# Altium project Mother Board.PrjPcb (part 1 of 2)
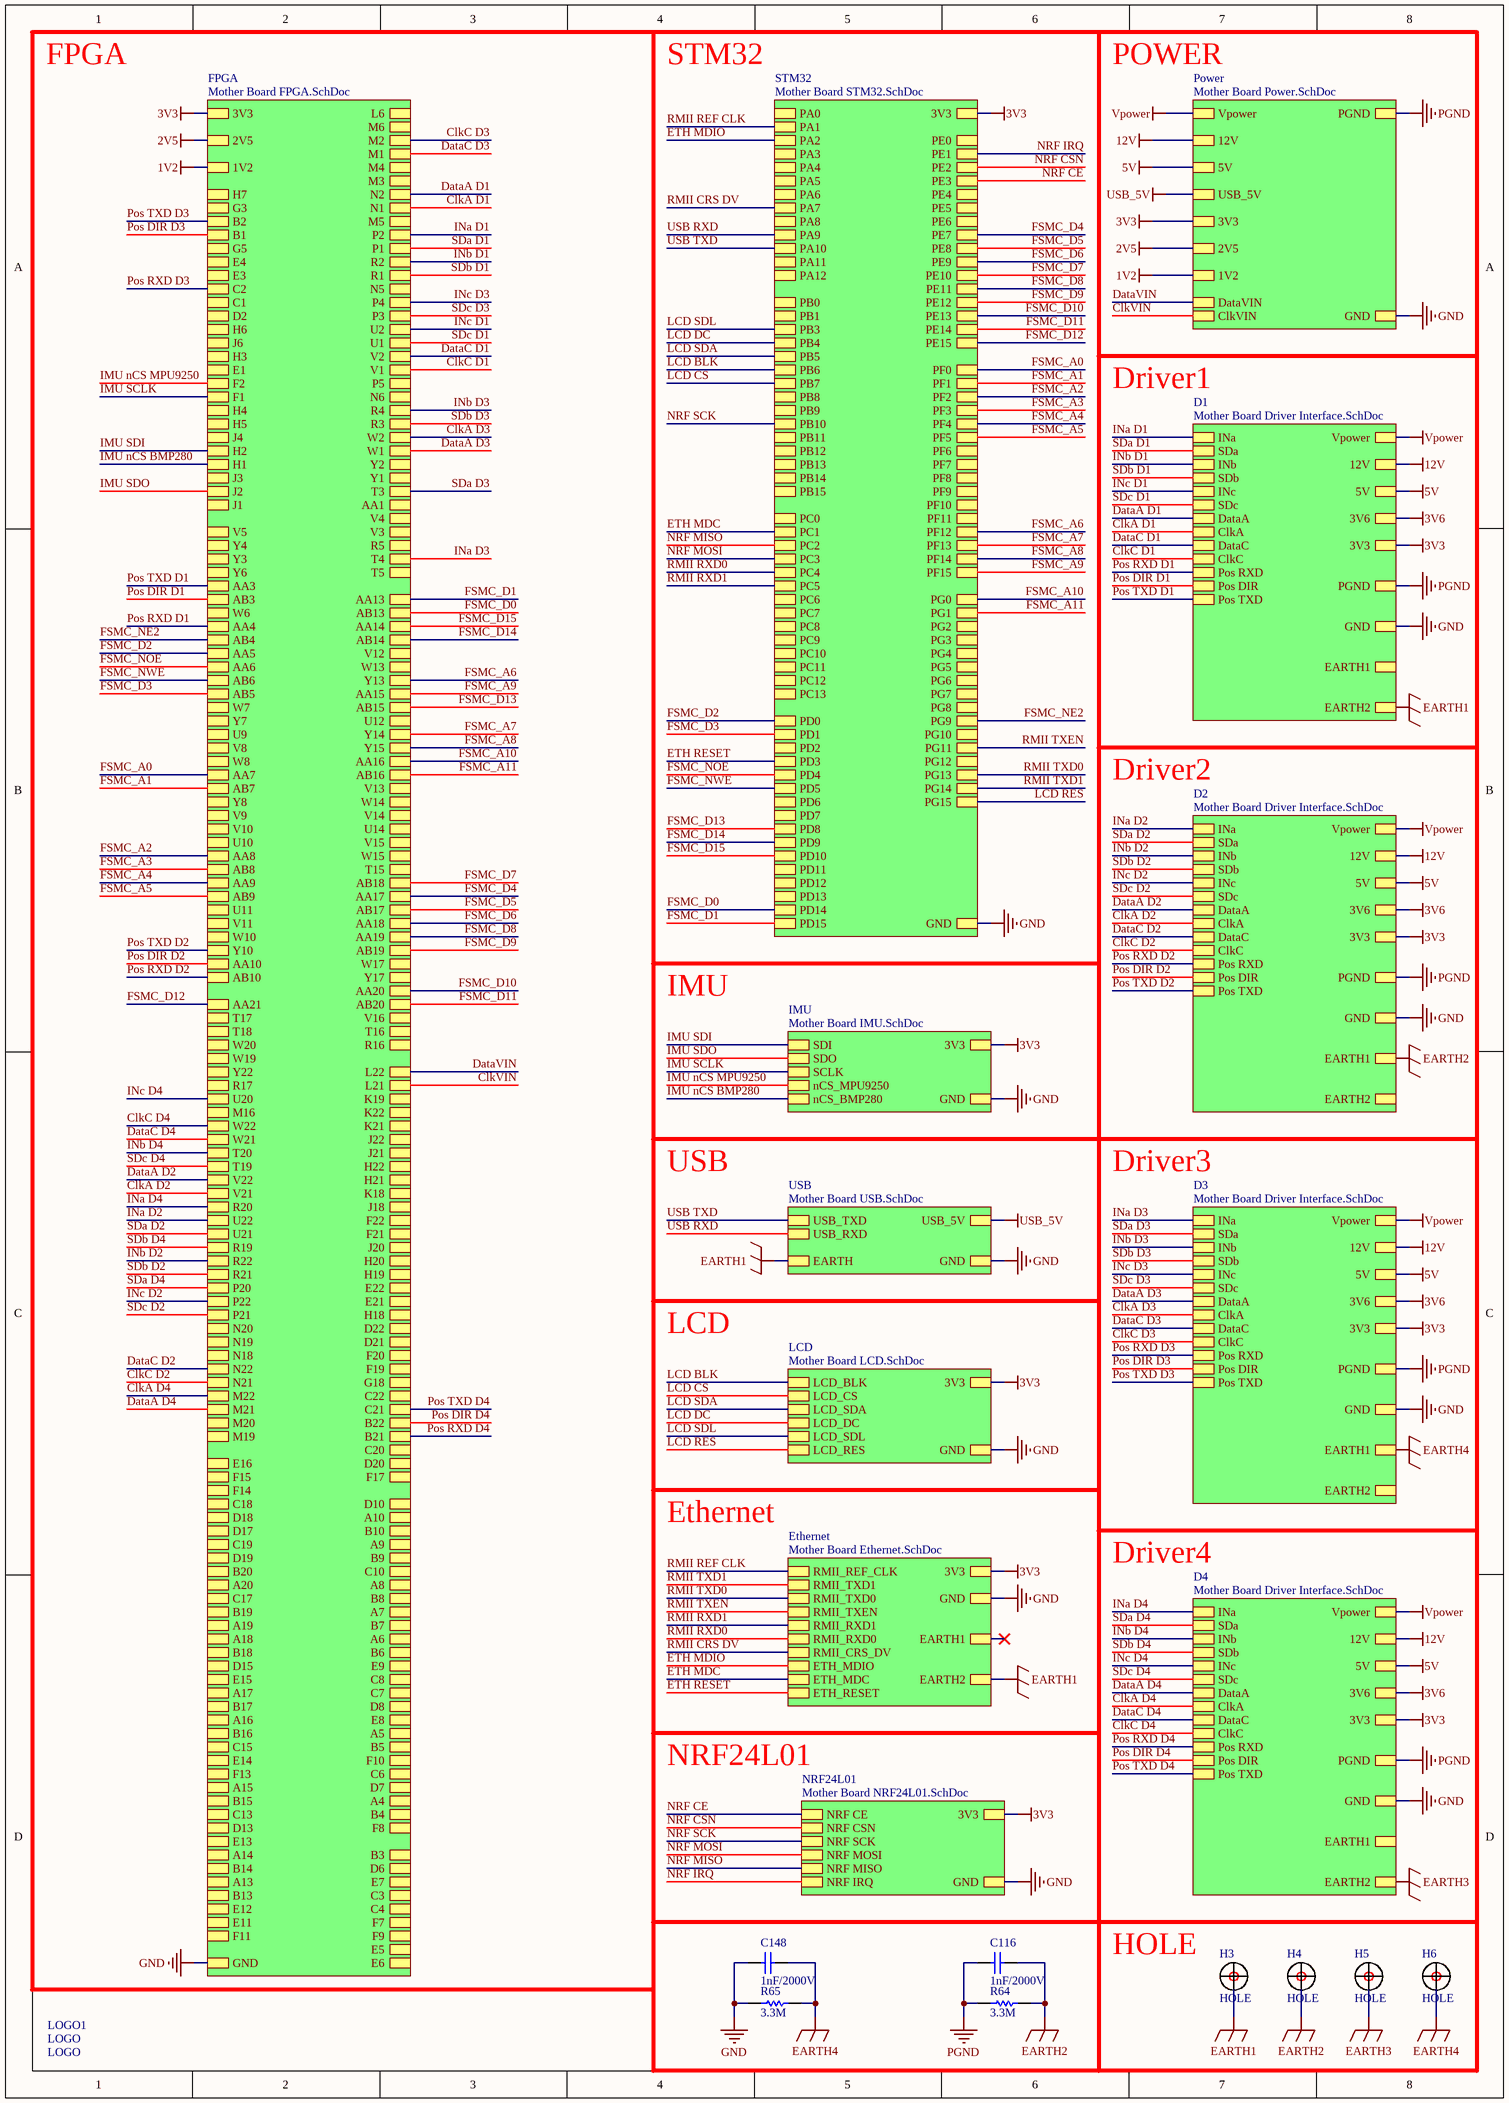
[diagram p0: Mother Board Main.SchDoc]
10 sheets, 316 parts. Net scope: hierarchical (ports join the sheet entries above them; power ports are global).
Board file: Mother  Board.PcbDoc
Sheets:
  Mother Board Main.SchDoc
    Power = Mother Board Power.SchDoc
    NRF24L01 = Mother Board NRF24L01.SchDoc
    IMU = Mother Board IMU.SchDoc
    USB = Mother Board USB.SchDoc
    LCD = Mother Board LCD.SchDoc
    Ethernet = Mother Board Ethernet.SchDoc
    D4 = Mother Board Driver Interface.SchDoc
    FPGA = Mother Board FPGA.SchDoc
    STM32 = Mother Board STM32.SchDoc
    D3 = Mother Board Driver Interface.SchDoc
    D2 = Mother Board Driver Interface.SchDoc
    D1 = Mother Board Driver Interface.SchDoc

## Sheet Mother Board Main.SchDoc
size A3 portrait

### Parts
C116  1nF/2000V  [C1206]
C148  1nF/2000V  [C1206]
H3  HOLE  [定位孔 Φ3 1]
H4  HOLE  [定位孔 Φ3 1]
H5  HOLE  [定位孔 Φ3 1]
H6  HOLE  [定位孔 Φ3 1]
LOGO1  LOGO  [LOGO]
R64  3.3M  [R1206]
R65  3.3M  [R1206]

### Sub-sheets
D1 = Mother Board Driver Interface.SchDoc: 12V, PGND, GND, 5V, 3V6, Vpower, INa, INb, INc, SDa, SDb, SDc, DataA, DataC, ClkA, ClkC, Pos DIR, Pos RXD, Pos TXD, 3V3, EARTH1, EARTH2
D2 = Mother Board Driver Interface.SchDoc: 12V, PGND, GND, 5V, 3V6, Vpower, INa, INb, INc, SDa, SDb, SDc, DataA, DataC, ClkA, ClkC, Pos DIR, Pos RXD, Pos TXD, 3V3, EARTH1, EARTH2
D3 = Mother Board Driver Interface.SchDoc: 12V, PGND, GND, 5V, 3V6, Vpower, INa, INb, INc, SDa, SDb, SDc, DataA, DataC, ClkA, ClkC, Pos DIR, Pos RXD, Pos TXD, 3V3, EARTH1, EARTH2
D4 = Mother Board Driver Interface.SchDoc: 12V, PGND, GND, 5V, 3V6, Vpower, INa, INb, INc, SDa, SDb, SDc, DataA, DataC, ClkA, ClkC, Pos DIR, Pos RXD, Pos TXD, 3V3, EARTH1, EARTH2
Ethernet = Mother Board Ethernet.SchDoc: 3V3, GND, RMII_REF_CLK, RMII_TXD1, RMII_TXD0, RMII_TXEN, RMII_RXD1, RMII_RXD0, RMII_CRS_DV, ETH_MDIO, ETH_MDC, ETH_RESET, EARTH1, EARTH2
FPGA = Mother Board FPGA.SchDoc: L6, M6, M2, M1, M4, M3, N2, N1, M5, P2, P1, R2, R1, N5, P4, P3, U2, U1, V2, V1, N6, R4, R3, W2, W1, Y2, Y1, T3, AA1, V4, V3, R5, T4, T5, P5, AA13, AA14, AB14, V12, W13, Y13, AA15, AB15, U12, Y14, Y15, AA16, AB16, V13, W14, V14, U14, V15, W15, T15, AB18, AA17, AB17, AA18, AA19, AB19, W17, Y17, AA20, AB20, V16, T16, R16, L22, L21, K19, K22, K21, J22, J21, H22, H21, K18, J18, F22, F21, J20, H20, H19, E22, E21, H18, D22, D21, F20, F19, G18, C22, C21, B22, B21, C20, D20, F17, D10, A10, B10, A9, B9, C10, A8, B8, A7, B7, A6, B6, E9, C8, C7, D8, E8, A5, B5, F10, C6, D7, A4, B4, F8, B3, D6, E7, C3, C4, F7, F9, E5, E6, H7, G3, B2, B1, G5, E4, E3, C2, C1, D2, H6, J6, H3, E1, F2, F1, H4, H5, J4, H2, H1, J3, J2, J1, V5, Y4, Y3, Y6, AA3, AB3, W6, AA4, AB4, AA5, AA6, AB6, AB5, W7, Y7, U9, V8, W8, AA7, AB7, Y8, V9, V10, U10, AA8, AB8, AA9, AB9, U11, V11, W10, Y10, AA10, AA21, T17, T18, W20, W19, Y22, R17, U20, M16, W22, W21, T20, T19, V22, V21, R20, U22, U21, R19, R22, R21, P20, P22, P21, N20, N19, N18, N22, N21, M22, M21, M20, M19, E16, F15, F14, C18, D18, D17, C19, D19, B20, A20, C17, B19, A19, A18, B18, D15, E15, A17, B17, A16, B16, C15, E14, F13, A15, B15, C13, D13, E13, A14, B14, A13, B13, E12, E11, F11, GND, 3V3, 2V5, 1V2, AB13, AB10
IMU = Mother Board IMU.SchDoc: 3V3, GND, SDI, SDO, SCLK, nCS_MPU9250, nCS_BMP280
LCD = Mother Board LCD.SchDoc: 3V3, GND, LCD_BLK, LCD_CS, LCD_SDA, LCD_DC, LCD_SDL, LCD_RES
NRF24L01 = Mother Board NRF24L01.SchDoc: NRF CE, 3V3, GND, NRF CSN, NRF SCK, NRF MOSI, NRF MISO, NRF IRQ
Power = Mother Board Power.SchDoc: 12V, 5V, Vpower, PGND, GND, DataVIN, ClkVIN, USB_5V, 3V3, 2V5, 1V2
STM32 = Mother Board STM32.SchDoc: GND, 3V3, PA0, PA1, PA2, PA3, PA4, PA5, PA6, PA7, PA8, PA9, PA10, PA11, PA12, PB0, PB1, PE0, PE1, PE2, PE3, PE4, PE5, PE6, PE7, PE8, PE9, PE10, PE11, PE12, PE13, PE14, PE15, PF0, PF1, PF2, PF3, PF4, PF5, PF6, PF7, PF8, PF9, PF10, PF11, PF12, PF13, PF14, PF15, PG0, PG1, PG2, PG3, PG4, PG5, PG6, PG7, PG8, PG9, PG10, PG11, PG12, PG13, PG14, PG15, PB5, PB6, PB7, PB8, PB9, PB10, PB11, PB12, PB13, PB14, PB15, PC0, PC1, PC2, PC3, PC4, PC5, PC6, PC7, PC8, PC9, PC10, PC11, PC12, PC13, PD0, PD1, PD2, PD3, PD4, PD5, PD6, PD7, PD8, PD9, PD10, PD11, PD12, PD13, PD14, PD15, PB3, PB4
USB = Mother Board USB.SchDoc: USB_TXD, USB_RXD, GND, USB_5V, EARTH

### Nets
1V2: sheet Power/1V2, sheet FPGA/1V2
2V5: sheet Power/2V5, sheet FPGA/2V5
3V3: sheet Power/3V3, sheet NRF24L01/3V3, sheet IMU/3V3, sheet LCD/3V3, sheet Ethernet/3V3, sheet D4/3V3, sheet FPGA/3V3, sheet STM32/3V3, sheet D3/3V3, sheet D2/3V3, sheet D1/3V3
3V6: sheet D4/3V6, sheet D3/3V6, sheet D2/3V6, sheet D1/3V6
5V: sheet Power/5V, sheet D4/5V, sheet D3/5V, sheet D2/5V, sheet D1/5V
12V: sheet Power/12V, sheet D4/12V, sheet D3/12V, sheet D2/12V, sheet D1/12V
EARTH1: C116.2 C148.2 H3.1 H4.1 H5.1 H6.1 R64.1 R65.1 ; sheet USB/EARTH, sheet Ethernet/EARTH1, sheet Ethernet/EARTH2, sheet D4/EARTH1, sheet D4/EARTH2, sheet D3/EARTH1, sheet D3/EARTH2, sheet D2/EARTH1, sheet D2/EARTH2, sheet D1/EARTH1, sheet D1/EARTH2  [also labelled EARTH2, EARTH3, EARTH4]  [project net EARTH]
GND: C148.1 R65.2 ; sheet Power/GND, sheet NRF24L01/GND, sheet IMU/GND, sheet USB/GND, sheet LCD/GND, sheet Ethernet/GND, sheet D4/GND, sheet FPGA/GND, sheet STM32/GND, sheet D3/GND, sheet D2/GND, sheet D1/GND
PGND: C116.1 R64.2 ; sheet Power/PGND, sheet D4/PGND, sheet D3/PGND, sheet D2/PGND, sheet D1/PGND
USB_5V: sheet Power/USB_5V, sheet USB/USB_5V
Vpower: sheet Power/Vpower, sheet D4/Vpower, sheet D3/Vpower, sheet D2/Vpower, sheet D1/Vpower
ClkA D1: sheet FPGA/N1, sheet D1/ClkA  [project net ClkA]
ClkA D2: sheet FPGA/V21, sheet D2/ClkA  [project net ClkA]
ClkA D3: sheet FPGA/W2, sheet D3/ClkA  [project net ClkA]
ClkA D4: sheet D4/ClkA, sheet FPGA/M22  [project net ClkA]
ClkC D1: sheet FPGA/V1, sheet D1/ClkC  [project net ClkC]
ClkC D2: sheet FPGA/N21, sheet D2/ClkC  [project net ClkC]
ClkC D3: sheet FPGA/M2, sheet D3/ClkC  [project net ClkC]
ClkC D4: sheet D4/ClkC, sheet FPGA/W22  [project net ClkC]
ClkVIN: sheet Power/ClkVIN, sheet FPGA/L21
DataA D1: sheet FPGA/N2, sheet D1/DataA  [project net DataA]
DataA D2: sheet FPGA/V22, sheet D2/DataA  [project net DataA]
DataA D3: sheet FPGA/W1, sheet D3/DataA  [project net DataA]
DataA D4: sheet D4/DataA, sheet FPGA/M21  [project net DataA]
DataC D1: sheet FPGA/V2, sheet D1/DataC  [project net DataC]
DataC D2: sheet FPGA/N22, sheet D2/DataC  [project net DataC]
DataC D3: sheet FPGA/M1, sheet D3/DataC  [project net DataC]
DataC D4: sheet D4/DataC, sheet FPGA/W21  [project net DataC]
DataVIN: sheet Power/DataVIN, sheet FPGA/L22
ETH MDC: sheet Ethernet/ETH_MDC, sheet STM32/PC1
ETH MDIO: sheet Ethernet/ETH_MDIO, sheet STM32/PA2
ETH RESET: sheet Ethernet/ETH_RESET, sheet STM32/PD3
FSMC_A0: sheet FPGA/AA7, sheet STM32/PF0
FSMC_A1: sheet FPGA/AB7, sheet STM32/PF1
FSMC_A2: sheet FPGA/AA8, sheet STM32/PF2
FSMC_A3: sheet FPGA/AB8, sheet STM32/PF3
FSMC_A4: sheet FPGA/AA9, sheet STM32/PF4
FSMC_A5: sheet FPGA/AB9, sheet STM32/PF5
FSMC_A6: sheet FPGA/Y13, sheet STM32/PF12
FSMC_A7: sheet FPGA/Y14, sheet STM32/PF13
FSMC_A8: sheet FPGA/Y15, sheet STM32/PF14
FSMC_A9: sheet FPGA/AA15, sheet STM32/PF15
FSMC_A10: sheet FPGA/AA16, sheet STM32/PG0
FSMC_A11: sheet FPGA/AB16, sheet STM32/PG1
FSMC_D0: sheet FPGA/AB13, sheet STM32/PD14
FSMC_D1: sheet FPGA/AA13, sheet STM32/PD15
FSMC_D2: sheet FPGA/AA5, sheet STM32/PD0
FSMC_D3: sheet FPGA/AB5, sheet STM32/PD1
FSMC_D4: sheet FPGA/AA17, sheet STM32/PE7
FSMC_D5: sheet FPGA/AB17, sheet STM32/PE8
FSMC_D6: sheet FPGA/AA18, sheet STM32/PE9
FSMC_D7: sheet FPGA/AB18, sheet STM32/PE10
FSMC_D8: sheet FPGA/AA19, sheet STM32/PE11
FSMC_D9: sheet FPGA/AB19, sheet STM32/PE12
FSMC_D10: sheet FPGA/AA20, sheet STM32/PE13
FSMC_D11: sheet FPGA/AB20, sheet STM32/PE14
FSMC_D12: sheet FPGA/AA21, sheet STM32/PE15
FSMC_D13: sheet FPGA/AB15, sheet STM32/PD8
FSMC_D14: sheet FPGA/AB14, sheet STM32/PD9
FSMC_D15: sheet FPGA/AA14, sheet STM32/PD10
FSMC_NE2: sheet FPGA/AB4, sheet STM32/PG9
FSMC_NOE: sheet FPGA/AA6, sheet STM32/PD4
FSMC_NWE: sheet FPGA/AB6, sheet STM32/PD5
IMU nCS BMP280: sheet IMU/nCS_BMP280, sheet FPGA/H1
IMU nCS MPU9250: sheet IMU/nCS_MPU9250, sheet FPGA/F2
IMU SCLK: sheet IMU/SCLK, sheet FPGA/F1
IMU SDI: sheet IMU/SDI, sheet FPGA/H2
IMU SDO: sheet IMU/SDO, sheet FPGA/J2
INa D1: sheet FPGA/P2, sheet D1/INa  [project net INa]
INa D2: sheet FPGA/U22, sheet D2/INa  [project net INa]
INa D3: sheet FPGA/T4, sheet D3/INa  [project net INa]
INa D4: sheet D4/INa, sheet FPGA/R20  [project net INa]
INb D1: sheet FPGA/R2, sheet D1/INb  [project net INb]
INb D2: sheet FPGA/R22, sheet D2/INb  [project net INb]
INb D3: sheet FPGA/R4, sheet D3/INb  [project net INb]
INb D4: sheet D4/INb, sheet FPGA/T20  [project net INb]
INc D1: sheet FPGA/U2, sheet D1/INc  [project net INc]
INc D2: sheet FPGA/P22, sheet D2/INc  [project net INc]
INc D3: sheet FPGA/P4, sheet D3/INc  [project net INc]
INc D4: sheet D4/INc, sheet FPGA/U20  [project net INc]
LCD BLK: sheet LCD/LCD_BLK, sheet STM32/PB6
LCD CS: sheet LCD/LCD_CS, sheet STM32/PB7
LCD DC: sheet LCD/LCD_DC, sheet STM32/PB4
LCD RES: sheet LCD/LCD_RES, sheet STM32/PG15
LCD SDA: sheet LCD/LCD_SDA, sheet STM32/PB5
LCD SDL: sheet LCD/LCD_SDL, sheet STM32/PB3
NRF CE: sheet NRF24L01/NRF CE, sheet STM32/PE3
NRF CSN: sheet NRF24L01/NRF CSN, sheet STM32/PE2
NRF IRQ: sheet NRF24L01/NRF IRQ, sheet STM32/PE1
NRF MISO: sheet NRF24L01/NRF MISO, sheet STM32/PC2
NRF MOSI: sheet NRF24L01/NRF MOSI, sheet STM32/PC3
NRF SCK: sheet NRF24L01/NRF SCK, sheet STM32/PB10
Pos DIR D1: sheet FPGA/AB3, sheet D1/Pos DIR  [project net Pos DIR]
Pos DIR D2: sheet FPGA/AA10, sheet D2/Pos DIR  [project net Pos DIR]
Pos DIR D3: sheet FPGA/B1, sheet D3/Pos DIR  [project net Pos DIR]
Pos DIR D4: sheet D4/Pos DIR, sheet FPGA/B22  [project net Pos DIR]
Pos RXD D1: sheet FPGA/AA4, sheet D1/Pos RXD  [project net Pos RXD]
Pos RXD D2: sheet FPGA/AB10, sheet D2/Pos RXD  [project net Pos RXD]
Pos RXD D3: sheet FPGA/C2, sheet D3/Pos RXD  [project net Pos RXD]
Pos RXD D4: sheet D4/Pos RXD, sheet FPGA/B21  [project net Pos RXD]
Pos TXD D1: sheet FPGA/AA3, sheet D1/Pos TXD  [project net Pos TXD]
Pos TXD D2: sheet FPGA/Y10, sheet D2/Pos TXD  [project net Pos TXD]
Pos TXD D3: sheet FPGA/B2, sheet D3/Pos TXD  [project net Pos TXD]
Pos TXD D4: sheet D4/Pos TXD, sheet FPGA/C21  [project net Pos TXD]
RMII CRS DV: sheet Ethernet/RMII_CRS_DV, sheet STM32/PA7
RMII REF CLK: sheet Ethernet/RMII_REF_CLK, sheet STM32/PA1
RMII RXD0: sheet Ethernet/RMII_RXD0, sheet STM32/PC4
RMII RXD1: sheet Ethernet/RMII_RXD1, sheet STM32/PC5
RMII TXD0: sheet Ethernet/RMII_TXD0, sheet STM32/PG13
RMII TXD1: sheet Ethernet/RMII_TXD1, sheet STM32/PG14
RMII TXEN: sheet Ethernet/RMII_TXEN, sheet STM32/PG11
SDa D1: sheet FPGA/P1, sheet D1/SDa  [project net SDa]
SDa D2: sheet FPGA/U21, sheet D2/SDa  [project net SDa]
SDa D3: sheet FPGA/T3, sheet D3/SDa  [project net SDa]
SDa D4: sheet D4/SDa, sheet FPGA/P20  [project net SDa]
SDb D1: sheet FPGA/R1, sheet D1/SDb  [project net SDb]
SDb D2: sheet FPGA/R21, sheet D2/SDb  [project net SDb]
SDb D3: sheet FPGA/R3, sheet D3/SDb  [project net SDb]
SDb D4: sheet D4/SDb, sheet FPGA/R19  [project net SDb]
SDc D1: sheet FPGA/U1, sheet D1/SDc  [project net SDc]
SDc D2: sheet FPGA/P21, sheet D2/SDc  [project net SDc]
SDc D3: sheet FPGA/P3, sheet D3/SDc  [project net SDc]
SDc D4: sheet D4/SDc, sheet FPGA/T19  [project net SDc]
USB RXD: sheet USB/USB_RXD, sheet STM32/PA9
USB TXD: sheet USB/USB_TXD, sheet STM32/PA10

### Notes on the sheet
- FPGA
- STM32
- POWER
- Driver1
- Driver2
- IMU
- USB
- Driver3
- LCD
- Ethernet
- Driver4
- NRF24L01
- HOLE

### Library data of the parts
C116 C148 = Cap
R64 R65 = RES

## Sheet Mother Board Power.SchDoc
size A4
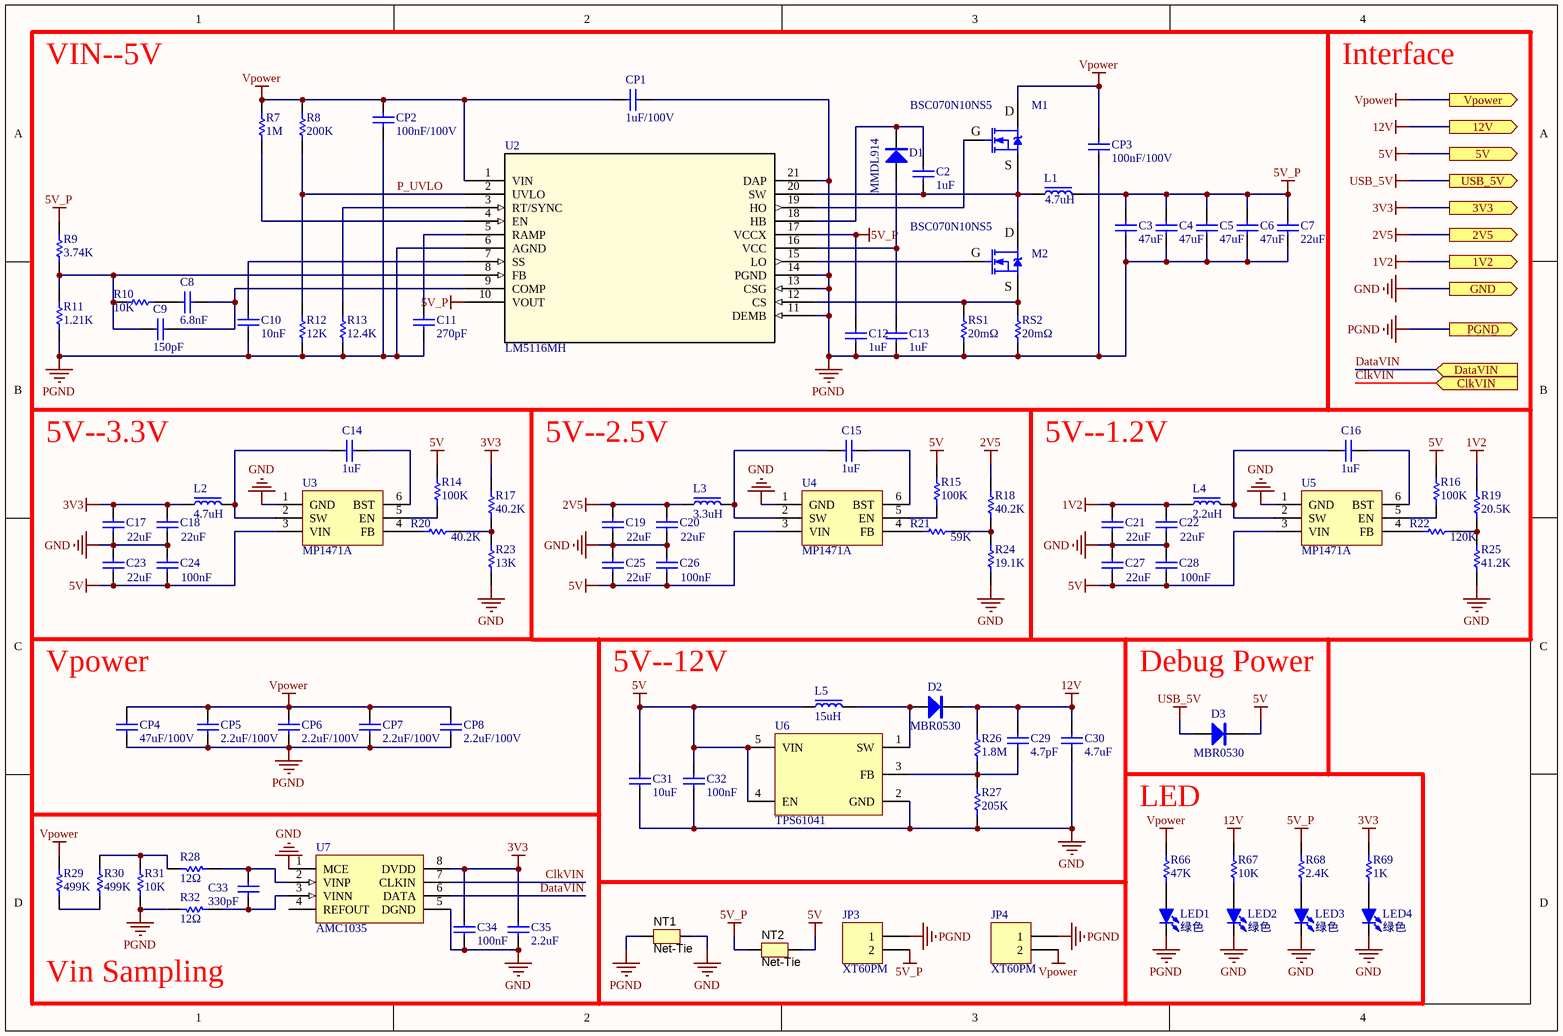
[diagram p1: Mother Board Power.SchDoc]

### Parts
C2  1uF  [C0805]
C3  47uF  [C0805]
C4  47uF  [C0805]
C5  47uF  [C0805]
C6  47uF  [C0805]
C7  22uF  [C0805]
C8  6.8nF  [C0603]
C9  150pF  [C0603]
C10  10nF  [C0603]
C11  270pF  [C0603]
C12  1uF  [C0805]
C13  1uF  [C0805]
C14  1uF  [C0603]
C15  1uF  [C0603]
C16  1uF  [C0603]
C17  22uF  [C0805]
C18  22uF  [C0805]
C19  22uF  [C0805]
C20  22uF  [C0805]
C21  22uF  [C0805]
C22  22uF  [C0805]
C23  22uF  [C0805]
C24  100nF  [C0603]
C25  22uF  [C0805]
C26  100nF  [C0603]
C27  22uF  [C0805]
C28  100nF  [C0603]
C29  4.7pF  [C0603]
C30  4.7uF  [C0805]
C31  10uF  [C0805]
C32  100nF  [C0603]
C33  330pF  [C0603]
C34  100nF  [C0603]
C35  2.2uF  [C0603]
CP1  1uF/100V  [C1206]
CP2  100nF/100V  [C1206]
CP3  100nF/100V  [C1206]
CP4  47uF/100V  [C1206]
CP5  2.2uF/100V  [C1206]
CP6  2.2uF/100V  [C1206]
CP7  2.2uF/100V  [C1206]
CP8  2.2uF/100V  [C1206]
D1  MMDL914  [SOD-323]
D2  MBR0530  [SOD-123]
D3  MBR0530  [SOD-123]
JP3  XT60PM  [XT60PM]
JP4  XT60PM  [XT60PM]
L1  4.7uH  [L 1040]
L2  4.7uH  [L 0530]
L3  3.3uH  [L 0530]
L4  2.2uH  [L 0530]
L5  15uH  [L 0530]
LED1  绿色  [LED 0603G L]
LED2  绿色  [LED 0603G L]
LED3  绿色  [LED 0603G L]
LED4  绿色  [LED 0603G L]
M1  BSC070N10NS5  [TDSON-8]
M2  BSC070N10NS5  [TDSON-8]
NT1  Net-Tie  [Net-Tie_80mil]  (net tie, no BOM)
NT2  Net-Tie  [Net-Tie_80mil]  (net tie, no BOM)
R7  1M  [R0603]
R8  200K  [R0603]
R9  3.74K  [R0603]
R10  10K  [R0603]
R11  1.21K  [R0603]
R12  12K  [R0603]
R13  12.4K  [R0603]
R14  100K  [R0603]
R15  100K  [R0603]
R16  100K  [R0603]
R17  40.2K  [R0603]
R18  40.2K  [R0603]
R19  20.5K  [R0603]
R20  40.2K  [R0603]
R21  59K  [R0603]
R22  120K  [R0603]
R23  13K  [R0603]
R24  19.1K  [R0603]
R25  41.2K  [R0603]
R26  1.8M  [R0603]
R27  205K  [R0603]
R28  12Ω  [R0603]
R29  499K  [R0603]
R30  499K  [R0603]
R31  10K  [R0603]
R32  12Ω  [R0603]
R66  47K  [R0603]
R67  10K  [R0603]
R68  2.4K  [R0603]
R69  1K  [R0603]
RS1  20mΩ  [R1206]
RS2  20mΩ  [R1206]
U2  LM5116MH  [MXA20A_TEX-L]
U3  MP1471A  [SOT23-6L]
U4  MP1471A  [SOT23-6L]
U5  MP1471A  [SOT23-6L]
U6  TPS61041  [SOT23-5L]
U7  AMC1035  [SOP8_L]

### Ports
1V2 (out), 2V5 (out), 3V3 (out), 5V (out), 12V (out), ClkVIN (in), DataVIN (in), GND (out), PGND (out), USB_5V (out), Vpower (out)

### Nets
1V2: C21.1 C22.1 L4.1 R19.2 ; port 1V2
2V5: C19.1 C20.1 L3.1 R18.2 ; port 2V5
3V3: C17.1 C18.1 C34.1 C35.1 L2.1 R17.2 R69.1 U7.8(DVDD) ; port 3V3
5V: C23.2 C24.2 C25.2 C26.2 C27.2 C28.2 C31.2 C32.2 D3.K L5.1 NT2.2 R14.1 R15.1 R16.1 U3.3(VIN) U4.3(VIN) U5.3(VIN) U6.4(EN) U6.5(VIN) ; port 5V
5V_P: C3.1 C4.1 C5.1 C6.1 C7.1 C12.1 JP3.2 L1.2 NT2.1 R9.2 R68.1 U2.10(VOUT) U2.17(VCCX)
12V: C29.2 C30.2 D2.K R26.1 R67.1 ; port 12V
GND: C17.2 C18.2 C19.2 C20.2 C21.2 C22.2 C23.1 C24.1 C25.1 C26.1 C27.1 C28.1 C30.1 C31.1 C32.1 C34.2 C35.2 LED2.K LED3.K LED4.K NT1.2 R23.2 R24.2 R25.2 R27.2 U3.1(GND) U4.1(GND) U5.1(GND) U6.2(GND) U7.1(MCE) U7.5(DGND) ; port GND
PGND: C3.2 C4.2 C5.2 C6.2 C7.2 C10.1 C11.1 C12.2 C13.2 CP1.2 CP2.1 CP3.1 CP4.2 CP5.2 CP6.2 CP7.2 CP8.2 JP3.1 JP4.1 LED1.K NT1.1 R11.2 R12.2 R13.2 R31.1 R32.1 RS1.1 RS2.1 U2.6(AGND) U2.11(DEMB) U2.13(CSG) U2.14(PGND) U2.21(DAP) ; port PGND
USB_5V: D3.A ; port USB_5V
Vpower: CP1.1 CP2.2 CP3.2 CP4.1 CP5.1 CP6.1 CP7.1 CP8.1 JP4.2 M1.D R7.1 R8.2 R29.2 R66.1 U2.1(VIN) ; port Vpower
ClkVIN: U7.7(CLKIN) ; port ClkVIN
DataVIN: U7.6(DATA) ; port DataVIN
P_UVLO: R8.1 R12.1 U2.2(UVLO)
NetC2_1: C2.1 L1.1 M1.S M2.D U2.20(SW)
NetC2_2: C2.2 D1.K U2.18(HB)
NetC8_1: C8.1 R10.2
NetC8_2: C8.2 C9.2 U2.9(COMP)
NetC9_1: C9.1 R9.1 R10.1 R11.1 U2.8(FB)
NetC10_2: C10.2 U2.7(SS)
NetC11_2: C11.2 U2.5(RAMP)
NetC13_1: C13.1 D1.A U2.16(VCC)
NetC14_1: C14.1 L2.2 U3.2(SW)
NetC14_2: C14.2 U3.6(BST)
NetC15_1: C15.1 L3.2 U4.2(SW)
NetC15_2: C15.2 U4.6(BST)
NetC16_1: C16.1 L4.2 U5.2(SW)
NetC16_2: C16.2 U5.6(BST)
NetC29_1: C29.1 R26.2 R27.1 U6.3(FB)
NetC33_1: C33.1 R32.2 U7.3(VINN)
NetC33_2: C33.2 R28.2 U7.2(VINP)
NetD2_A: D2.A L5.2 U6.1(SW)
NetLED1_A: LED1.A R66.2
NetLED2_A: LED2.A R67.2
NetLED3_A: LED3.A R68.2
NetLED4_A: LED4.A R69.2
NetM1_G: M1.G U2.19(HO)
NetM2_G: M2.G U2.15(LO)
NetM2_S: M2.S RS1.2 RS2.2 U2.12(CS)
NetR7_2: R7.2 U2.4(EN)
NetR13_1: R13.1 U2.3(RT/SYNC)
NetR14_2: R14.2 U3.5(EN)
NetR15_2: R15.2 U4.5(EN)
NetR16_2: R16.2 U5.5(EN)
NetR17_1: R17.1 R20.1 R23.1
NetR18_1: R18.1 R21.1 R24.1
NetR19_1: R19.1 R22.1 R25.1
NetR20_2: R20.2 U3.4(FB)
NetR21_2: R21.2 U4.4(FB)
NetR22_2: R22.2 U5.4(FB)
NetR28_1: R28.1 R30.1 R31.2
NetR29_1: R29.1 R30.2

Not connected (* = marked no-connect by the designer): U7 4(REFOUT)

### Notes on the sheet
- VIN--5V
- Interface
- 5V--3.3V
- 5V--2.5V
- 5V--1.2V
- (near CP4) Vpower
- 5V--12V
- Debug Power
- LED
- Vin Sampling

### Library data of the parts
C2-C35 CP1-CP8 = Cap
D1 = MMDL914: 100V 0.2A开关管
D2 D3 = MBR0530: 30V 0.5A
L1-L5 = L-CDRH: 功率屏蔽电感
LED1-LED4 = LED-SMD: 贴片LED; 版权归属: 源创客; BOM名称: 贴片LED; 学习资源: www.ooocke.com
M1 M2 = BSC070N10NS5: N沟场效应管
NT1 NT2 = Net-Tie: Single point connection between nets.; SymbolCreator: codlsc; SymbolVersion: 2009-07-01; MountType: SMT; Publisher: Texas Instruments; LatestRevisionDate: 2013-04-21; LatestRevisionNote: Added Alternate PartNumber and Alternate Manufacturer parameters to appropriate components.
R7-R32 R66-R69 RS1 RS2 = RES
U2 = LM5116MH: No Description Available; Mfr_Name: Texas Instruments; Copyright: Copyright (C) 2021 Ultra Librarian. All rights reserved.; Manufacturer_Part_Number: LM5116MH; RefDes: RefDes; Type: DEV
U3-U5 = MP1471A: 4.5-16V输入 DC-DC Buck 芯片
U6 = TPS6104x: Boost DC-DC

## Sheet Mother Board NRF24L01.SchDoc
size A4
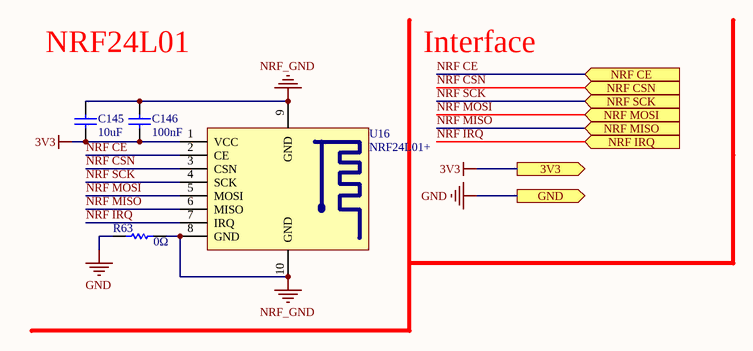
[diagram p2: Mother Board NRF24L01.SchDoc]

### Parts
C145  10uF  [C0805]
C146  100nF  [C0603]
R63  0Ω  [R0603]
U16  NRF24L01+  [NRF24L01+]

### Ports
3V3 (out), GND (out), NRF CE (in), NRF CSN (in), NRF IRQ (in), NRF MISO (in), NRF MOSI (in), NRF SCK (in)

### Nets
3V3: C145.1 C146.1 U16.1(VCC) ; port 3V3
GND: R63.2 ; port GND
NRF_GND: C145.2 C146.2 R63.1 U16.8(GND) U16.9(GND) U16.10(GND)
NRF CE: U16.2(CE) ; port NRF CE
NRF CSN: U16.3(CSN) ; port NRF CSN
NRF IRQ: U16.7(IRQ) ; port NRF IRQ
NRF MISO: U16.6(MISO) ; port NRF MISO
NRF MOSI: U16.5(MOSI) ; port NRF MOSI
NRF SCK: U16.4(SCK) ; port NRF SCK

### Notes on the sheet
- NRF24L01
- Interface

### Library data of the parts
C145 C146 = Cap
R63 = RES

## Sheet Mother Board IMU.SchDoc
size A4
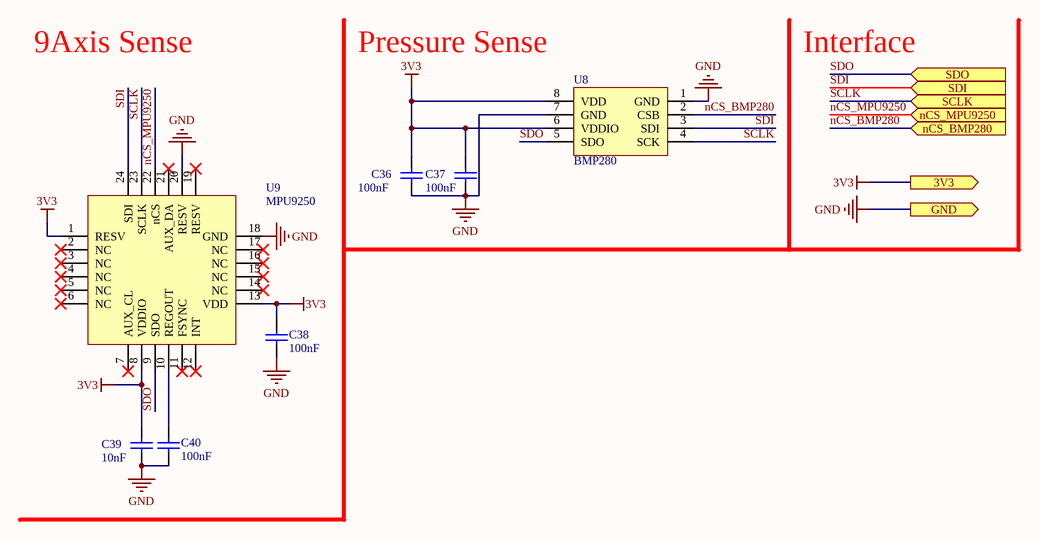
[diagram p3: Mother Board IMU.SchDoc]

### Parts
C36  100nF  [C0603]
C37  100nF  [C0603]
C38  100nF  [C0603]
C39  10nF  [C0603]
C40  100nF  [C0603]
U8  BMP280  [BMP280]
U9  MPU9250  [QFN24 3*3]

### Ports
3V3 (out), GND (out), nCS_BMP280 (in), nCS_MPU9250 (in), SCLK (in), SDI (in), SDO (in)

### Nets
3V3: C36.2 C37.2 C38.2 C39.2 U8.6(VDDIO) U8.8(VDD) U9.1(RESV) U9.8(VDDIO) U9.13(VDD) ; port 3V3
GND: C36.1 C37.1 C38.1 C39.1 C40.1 U8.1(GND) U8.7(GND) U9.18(GND) U9.20(RESV) ; port GND
nCS_BMP280: U8.2(CSB) ; port nCS_BMP280  [project net IMU nCS BMP280]
nCS_MPU9250: U9.22(nCS) ; port nCS_MPU9250  [project net IMU nCS MPU9250]
SCLK: U8.4(SCK) U9.23(SCLK) ; port SCLK  [project net IMU SCLK]
SDI: U8.3(SDI) U9.24(SDI) ; port SDI  [project net IMU SDI]
SDO: U8.5(SDO) U9.9(SDO) ; port SDO  [project net IMU SDO]
NetC40_2: C40.2 U9.10(REGOUT)

Not connected (* = marked no-connect by the designer): U9 2(NC)* 3(NC)* 4(NC)* 5(NC)* 6(NC)* 7(AUX_CL)* 11(FSYNC)* 12(INT)* 14(NC)* 15(NC)* 16(NC)* 17(NC)* 19(RESV)* 21(AUX_DA)*

### Notes on the sheet
- 9Axis Sense
- (near U8) Pressure Sense
- Interface

### Library data of the parts
C36-C40 = Cap
U8 = BMP280: 气压计
U9 = MPU9250: 9轴 加速度 角速度 地磁传感器

## Sheet Mother Board USB.SchDoc
size A4
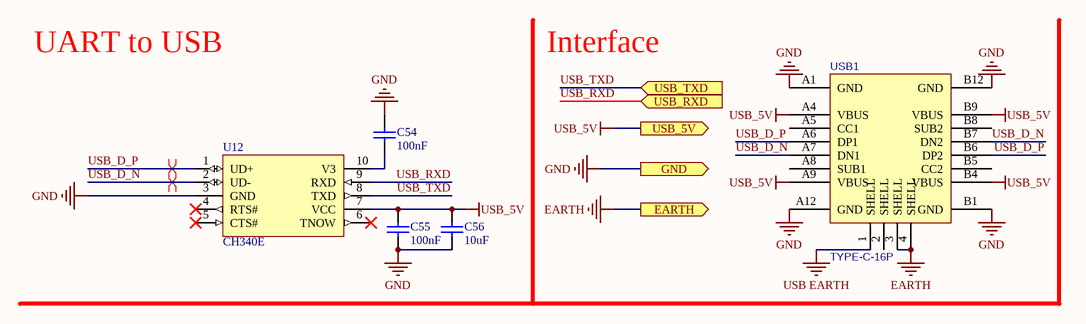
[diagram p4: Mother Board USB.SchDoc]

### Parts
C54  100nF  [C0603]
C55  100nF  [C0603]
C56  10uF  [C0603]
U12  CH340E  [MSOP10]
USB1  TYPE-C-16P  [USB-C_16P]

### Ports
EARTH (out), GND (out), USB_5V (out), USB_RXD (in), USB_TXD (in)

### Nets
EARTH: USB1.3(SHELL) USB1.4(SHELL) ; port EARTH
GND: C54.2 C55.2 C56.2 U12.3(GND) USB1.A1(GND) USB1.A12(GND) USB1.B1(GND) USB1.B12(GND) ; port GND
USB EARTH: USB1.1(SHELL)
USB_5V: C55.1 C56.1 U12.7(VCC) USB1.A4(VBUS) USB1.A9(VBUS) USB1.B4(VBUS) USB1.B9(VBUS) ; port USB_5V
USB_D_N: U12.2(UD-) USB1.A7(DN1) USB1.B7(DN2)
USB_D_P: U12.1(UD+) USB1.A6(DP1) USB1.B6(DP2)
USB_RXD: U12.9(RXD) ; port USB_RXD  [project net USB RXD]
USB_TXD: U12.8(TXD) ; port USB_TXD  [project net USB TXD]
NetC54_1: C54.1 U12.10(V3)

Not connected (* = marked no-connect by the designer): U12 4(RTS#)* 5(CTS#)* 6(TNOW)*; USB1 2(SHELL) A5(CC1) A8(SUB1) B5(CC2) B8(SUB2)

### Layout directives
differential pair: USB_D_N, USB_D_P

### Notes on the sheet
- UART to USB
- Interface

### Library data of the parts
C54 C55 = Cap_100nF
C56 = Cap
U12 = CH340E: USB to TTL Serial / UART
USB1 = USB-C-16P: BOM_Manufacturer: Shenzhen Kinghelm Elec; BOM_Manufacturer Part: KH-TYPE-C-16P; Contributor: LCSC; BOM_Supplier: LCSC; BOM_Supplier Part: C709357; BOM_JLCPCB Part Class: Extended Part; spicePre: U; spiceSymbolName: KH-TYPE-C-16P

## Sheet Mother Board LCD.SchDoc
size A4
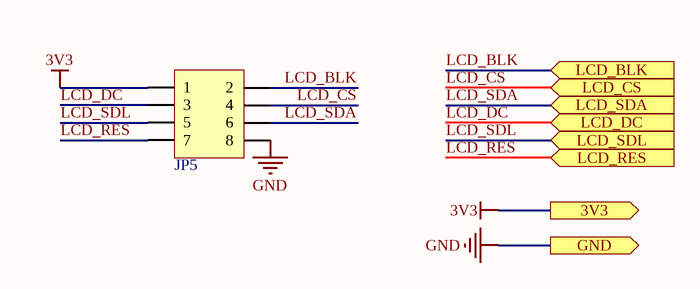
[diagram p5: Mother Board LCD.SchDoc]

### Parts
JP5  Header 4X2  [HEARDER_0.8mm_2x4P_G]  (value not drawn)

### Ports
3V3 (out), GND (out), LCD_BLK (in), LCD_CS (in), LCD_DC (in), LCD_RES (in), LCD_SDA (in), LCD_SDL (in)

### Nets
3V3: JP5.1 ; port 3V3
GND: JP5.8 ; port GND
LCD_BLK: JP5.2 ; port LCD_BLK  [project net LCD BLK]
LCD_CS: JP5.4 ; port LCD_CS  [project net LCD CS]
LCD_DC: JP5.3 ; port LCD_DC  [project net LCD DC]
LCD_RES: JP5.7 ; port LCD_RES  [project net LCD RES]
LCD_SDA: JP5.6 ; port LCD_SDA  [project net LCD SDA]
LCD_SDL: JP5.5 ; port LCD_SDL  [project net LCD SDL]

### Library data of the parts
JP5 = Header 4PX2: 4*2P接插件; 版权归属: 源创客; BOM名称: 4*2P接插件; 学习资源: www.ooocke.com

## Sheet Mother Board Ethernet.SchDoc
size A4
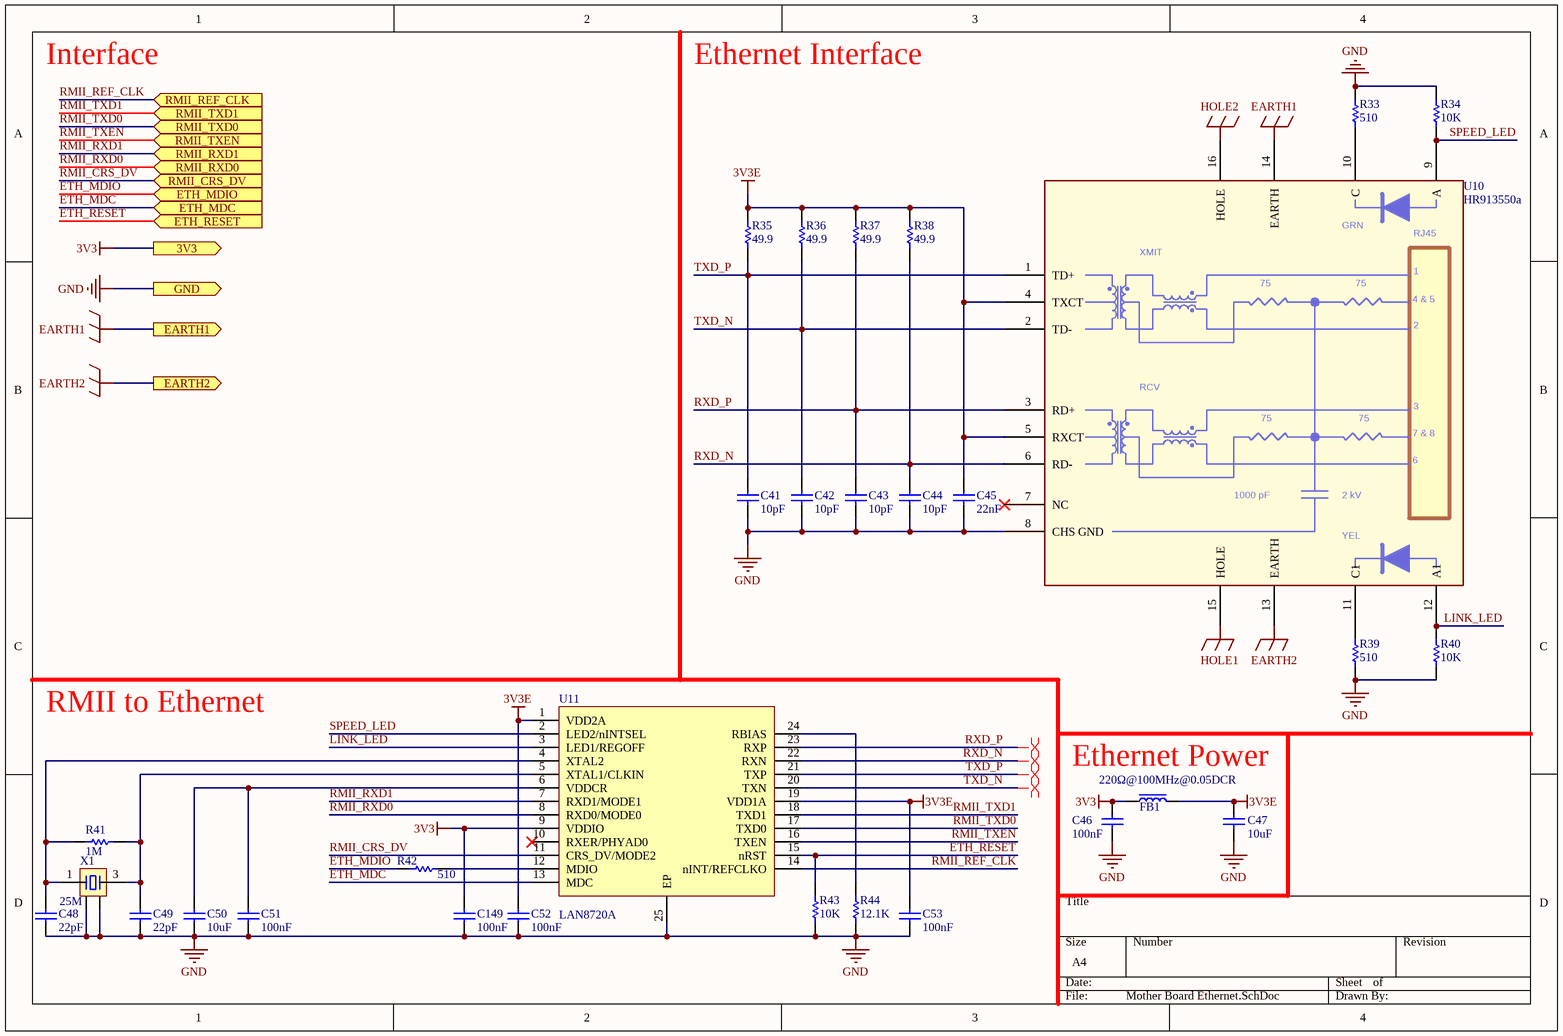
[diagram p6: Mother Board Ethernet.SchDoc]

### Parts
C41  10pF  [C0603]
C42  10pF  [C0603]
C43  10pF  [C0603]
C44  10pF  [C0603]
C45  22nF  [C0603]
C46  100nF  [C0603]
C47  10uF  [C0603]
C48  22pF  [C0603]
C49  22pF  [C0603]
C50  10uF  [C0603]
C51  100nF  [C0603]
C52  100nF  [C0603]
C53  100nF  [C0603]
C149  100nF  [C0603]
FB1  220Ω@100MHz@0.05DCR  [FB 0603]
R33  510  [R0603]
R34  10K  [R0603]
R35  49.9  [R0603]
R36  49.9  [R0603]
R37  49.9  [R0603]
R38  49.9  [R0603]
R39  510  [R0603]
R40  10K  [R0603]
R41  1M  [R0603]
R42  510  [R0603]
R43  10K  [R0603]
R44  12.1K  [R0603]
U10  HR913550a  [RJ45-TH_HR913550A]
U11  LAN8720A  [QFN24]
X1  25M  [XTAL-3225]

### Ports
3V3 (out), EARTH1 (out), EARTH2 (out), ETH_MDC (in), ETH_MDIO (in), ETH_RESET (in), GND (out), RMII_CRS_DV (in), RMII_REF_CLK (in), RMII_RXD0 (in), RMII_RXD1 (in), RMII_TXD0 (in), RMII_TXD1 (in), RMII_TXEN (in)

### Nets
3V3: C46.2 C149.1 FB1.1 U11.9(VDDIO) ; port 3V3
3V3E: C45.2 C47.2 C52.1 C53.1 FB1.2 R35.2 R36.2 R37.2 R38.2 U10.4(TXCT) U10.5(RXCT) U11.1(VDD2A) U11.19(VDD1A)
EARTH1: U10.13(EARTH) U10.14(EARTH) ; port EARTH1, port EARTH2  [also labelled EARTH2]  [project net EARTH]
GND: C41.1 C42.1 C43.1 C44.1 C45.1 C46.1 C47.1 C48.2 C49.2 C50.2 C51.2 C52.2 C53.2 C149.2 R33.1 R34.1 R39.1 R40.1 R43.2 R44.1 U10.8(CHS_GND) U11.25(EP) X1.2 X1.4 ; port GND
HOLE1: U10.15(HOLE)
HOLE2: U10.16(HOLE)
ETH_MDC: U11.13(MDC) ; port ETH_MDC  [project net ETH MDC]
ETH_MDIO: R42.1 ; port ETH_MDIO  [project net ETH MDIO]
ETH_RESET: R43.1 U11.15(nRST) ; port ETH_RESET  [project net ETH RESET]
LINK_LED: R40.2 U10.12(A1) U11.3(LED1/REGOFF)
RMII_CRS_DV: U11.11(CRS_DV/MODE2) ; port RMII_CRS_DV  [project net RMII CRS DV]
RMII_REF_CLK: U11.14(nINT/REFCLKO) ; port RMII_REF_CLK  [project net RMII REF CLK]
RMII_RXD0: U11.8(RXD0/MODE0) ; port RMII_RXD0  [project net RMII RXD0]
RMII_RXD1: U11.7(RXD1/MODE1) ; port RMII_RXD1  [project net RMII RXD1]
RMII_TXD0: U11.17(TXD0) ; port RMII_TXD0  [project net RMII TXD0]
RMII_TXD1: U11.18(TXD1) ; port RMII_TXD1  [project net RMII TXD1]
RMII_TXEN: U11.16(TXEN) ; port RMII_TXEN  [project net RMII TXEN]
RXD_N: C44.2 R38.1 U10.6(RD-) U11.22(RXN)
RXD_P: C43.2 R37.1 U10.3(RD+) U11.23(RXP)
SPEED_LED: R34.2 U10.9(A) U11.2(LED2/nINTSEL)
TXD_N: C42.2 R36.1 U10.2(TD-) U11.20(TXN)
TXD_P: C41.2 R35.1 U10.1(TD+) U11.21(TXP)
NetC48_1: C48.1 R41.2 U11.4(XTAL2) X1.1
NetC49_1: C49.1 R41.1 U11.5(XTAL1/CLKIN) X1.3
NetC50_1: C50.1 C51.1 U11.6(VDDCR)
NetR33_2: R33.2 U10.10(C)
NetR39_2: R39.2 U10.11(C1)
NetR42_2: R42.2 U11.12(MDIO)
NetR44_2: R44.2 U11.24(RBIAS)

Not connected (* = marked no-connect by the designer): U10 7(NC)*; U11 10(RXER/PHYAD0)*

### Layout directives
differential pair: RXD_N, RXD_P, TXD_N, TXD_P

### Notes on the sheet
- Interface
- Ethernet Interface
- RMII to Ethernet
- Ethernet Power
- (in symbol HR913550a) GRN; RJ45; XMIT; 75; 4 & 5; RCV; 7 & 8; 1000 pF; 2 kV; YEL

### Library data of the parts
C41-C53 C149 = Cap
FB1 = FB: 磁珠
R33-R44 = RES
U11 = LAN8720A: RMII Ethernet 网口芯片
X1 = XTAL-4: 4脚晶振; 版权归属: 源创客; BOM名称: 4脚晶振; 学习资源: www.ooocke.com
U10 = HR913550a: HR911205C_A: *; HR911205C_B: *

## Sheet Mother Board Driver Interface.SchDoc
size A4
Used 4 times, as channels D4, D3, D2, D1. Parts and nets are listed once, with the designators drawn on the sheet.
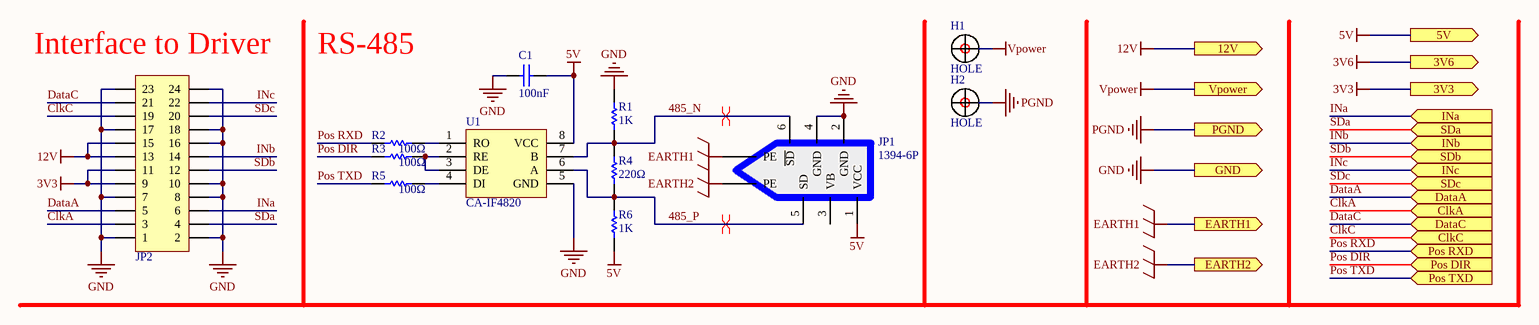
[diagram p7: Mother Board Driver Interface.SchDoc]

### Parts
C1  100nF  [C0603]
H1  HOLE  [定位孔 Φ3 1]
H2  HOLE  [定位孔 Φ3 1]
JP1  1394-6P  [1394-6P]
JP2  Header 2X12  [HEADER_0.8mm_2x12P_M]  (value not drawn)
R1  1K  [R0603]
R2  100Ω  [R0603]
R3  100Ω  [R0603]
R4  220Ω  [R0603]
R5  100Ω  [R0603]
R6  1K  [R0603]
U1  CA-IF4820  [SOP8_N]

### Ports
3V3 (out), 3V6 (out), 5V (out), 12V (out), ClkA (in), ClkC (in), DataA (in), DataC (in), EARTH1 (out), EARTH2 (out), GND (out), INa (in), INb (in), INc (in), PGND (out), Pos DIR (in), Pos RXD (in), Pos TXD (in), SDa (in), SDb (in), SDc (in), Vpower (out)

### Nets
3V3: JP2.9 JP2.11 ; port 3V3
5V: C1.2 JP1.1(VCC) R6.1 U1.8(VCC) ; port 5V
12V: JP2.13 JP2.15 ; port 12V
EARTH1: JP1.7(PE) ; port EARTH1
EARTH2: JP1.8(PE) ; port EARTH2
GND: C1.1 JP1.2(GND) JP1.4(GND) JP2.1 JP2.2 JP2.7 JP2.8 JP2.10 JP2.16 JP2.17 JP2.18 JP2.23 JP2.24 R1.2 U1.5(GND) ; port GND
PGND: H2.1 ; port PGND
Vpower: H1.1 ; port Vpower
485_N: JP1.6(~{SD}) R1.1 R4.2 U1.7(B)
485_P: JP1.5(SD) R4.1 R6.2 U1.6(A)
ClkA: JP2.3 ; port ClkA
ClkC: JP2.19 ; port ClkC
DataA: JP2.5 ; port DataA
DataC: JP2.21 ; port DataC
INa: JP2.6 ; port INa
INb: JP2.14 ; port INb
INc: JP2.22 ; port INc
Pos DIR: R3.1 ; port Pos DIR
Pos RXD: R2.1 ; port Pos RXD
Pos TXD: R5.1 ; port Pos TXD
SDa: JP2.4 ; port SDa
SDb: JP2.12 ; port SDb
SDc: JP2.20 ; port SDc
NetR2_2: R2.2 U1.1(RO)
NetR3_2: R3.2 U1.2(RE) U1.3(DE)
NetR5_2: R5.2 U1.4(DI)

Not connected (* = marked no-connect by the designer): JP1 3(VB)

### Channels
D4: designators end in _D4; ports 3V3=3V3 3V6=3V6 5V=5V 12V=12V ClkA=ClkA ClkC=ClkC DataA=DataA DataC=DataC EARTH1=EARTH EARTH2=EARTH GND=GND INa=INa INb=INb INc=INc PGND=PGND Pos DIR=Pos DIR Pos RXD=Pos RXD Pos TXD=Pos TXD SDa=SDa SDb=SDb SDc=SDc Vpower=Vpower
D3: designators end in _D3; ports 3V3=3V3 3V6=3V6 5V=5V 12V=12V ClkA=ClkA ClkC=ClkC DataA=DataA DataC=DataC EARTH1=EARTH EARTH2=EARTH GND=GND INa=INa INb=INb INc=INc PGND=PGND Pos DIR=Pos DIR Pos RXD=Pos RXD Pos TXD=Pos TXD SDa=SDa SDb=SDb SDc=SDc Vpower=Vpower
D2: designators end in _D2; ports 3V3=3V3 3V6=3V6 5V=5V 12V=12V ClkA=ClkA ClkC=ClkC DataA=DataA DataC=DataC EARTH1=EARTH EARTH2=EARTH GND=GND INa=INa INb=INb INc=INc PGND=PGND Pos DIR=Pos DIR Pos RXD=Pos RXD Pos TXD=Pos TXD SDa=SDa SDb=SDb SDc=SDc Vpower=Vpower
D1: designators end in _D1; ports 3V3=3V3 3V6=3V6 5V=5V 12V=12V ClkA=ClkA ClkC=ClkC DataA=DataA DataC=DataC EARTH1=EARTH EARTH2=EARTH GND=GND INa=INa INb=INb INc=INc PGND=PGND Pos DIR=Pos DIR Pos RXD=Pos RXD Pos TXD=Pos TXD SDa=SDa SDb=SDb SDc=SDc Vpower=Vpower

### Layout directives
differential pair: 485_N_D4, 485_P_D4

### Notes on the sheet
- (near JP2) Interface to Driver
- RS-485

### Library data of the parts
C1 = Cap
JP1 = 1394-6P: IEEE 1394 FireWire接口
JP2 = Header 12PX2: 12*2P接插件; 版权归属: 源创客; BOM名称: 12*2P接插件; 学习资源: www.ooocke.com
R1-R6 = RES
U1 = CA-IF4820: 485总线芯片